# Altium schematic sheet Microcontroller+Memory.SchDoc
size 420 x 297 mm; SheetNumber: 1; SheetTotal: 3
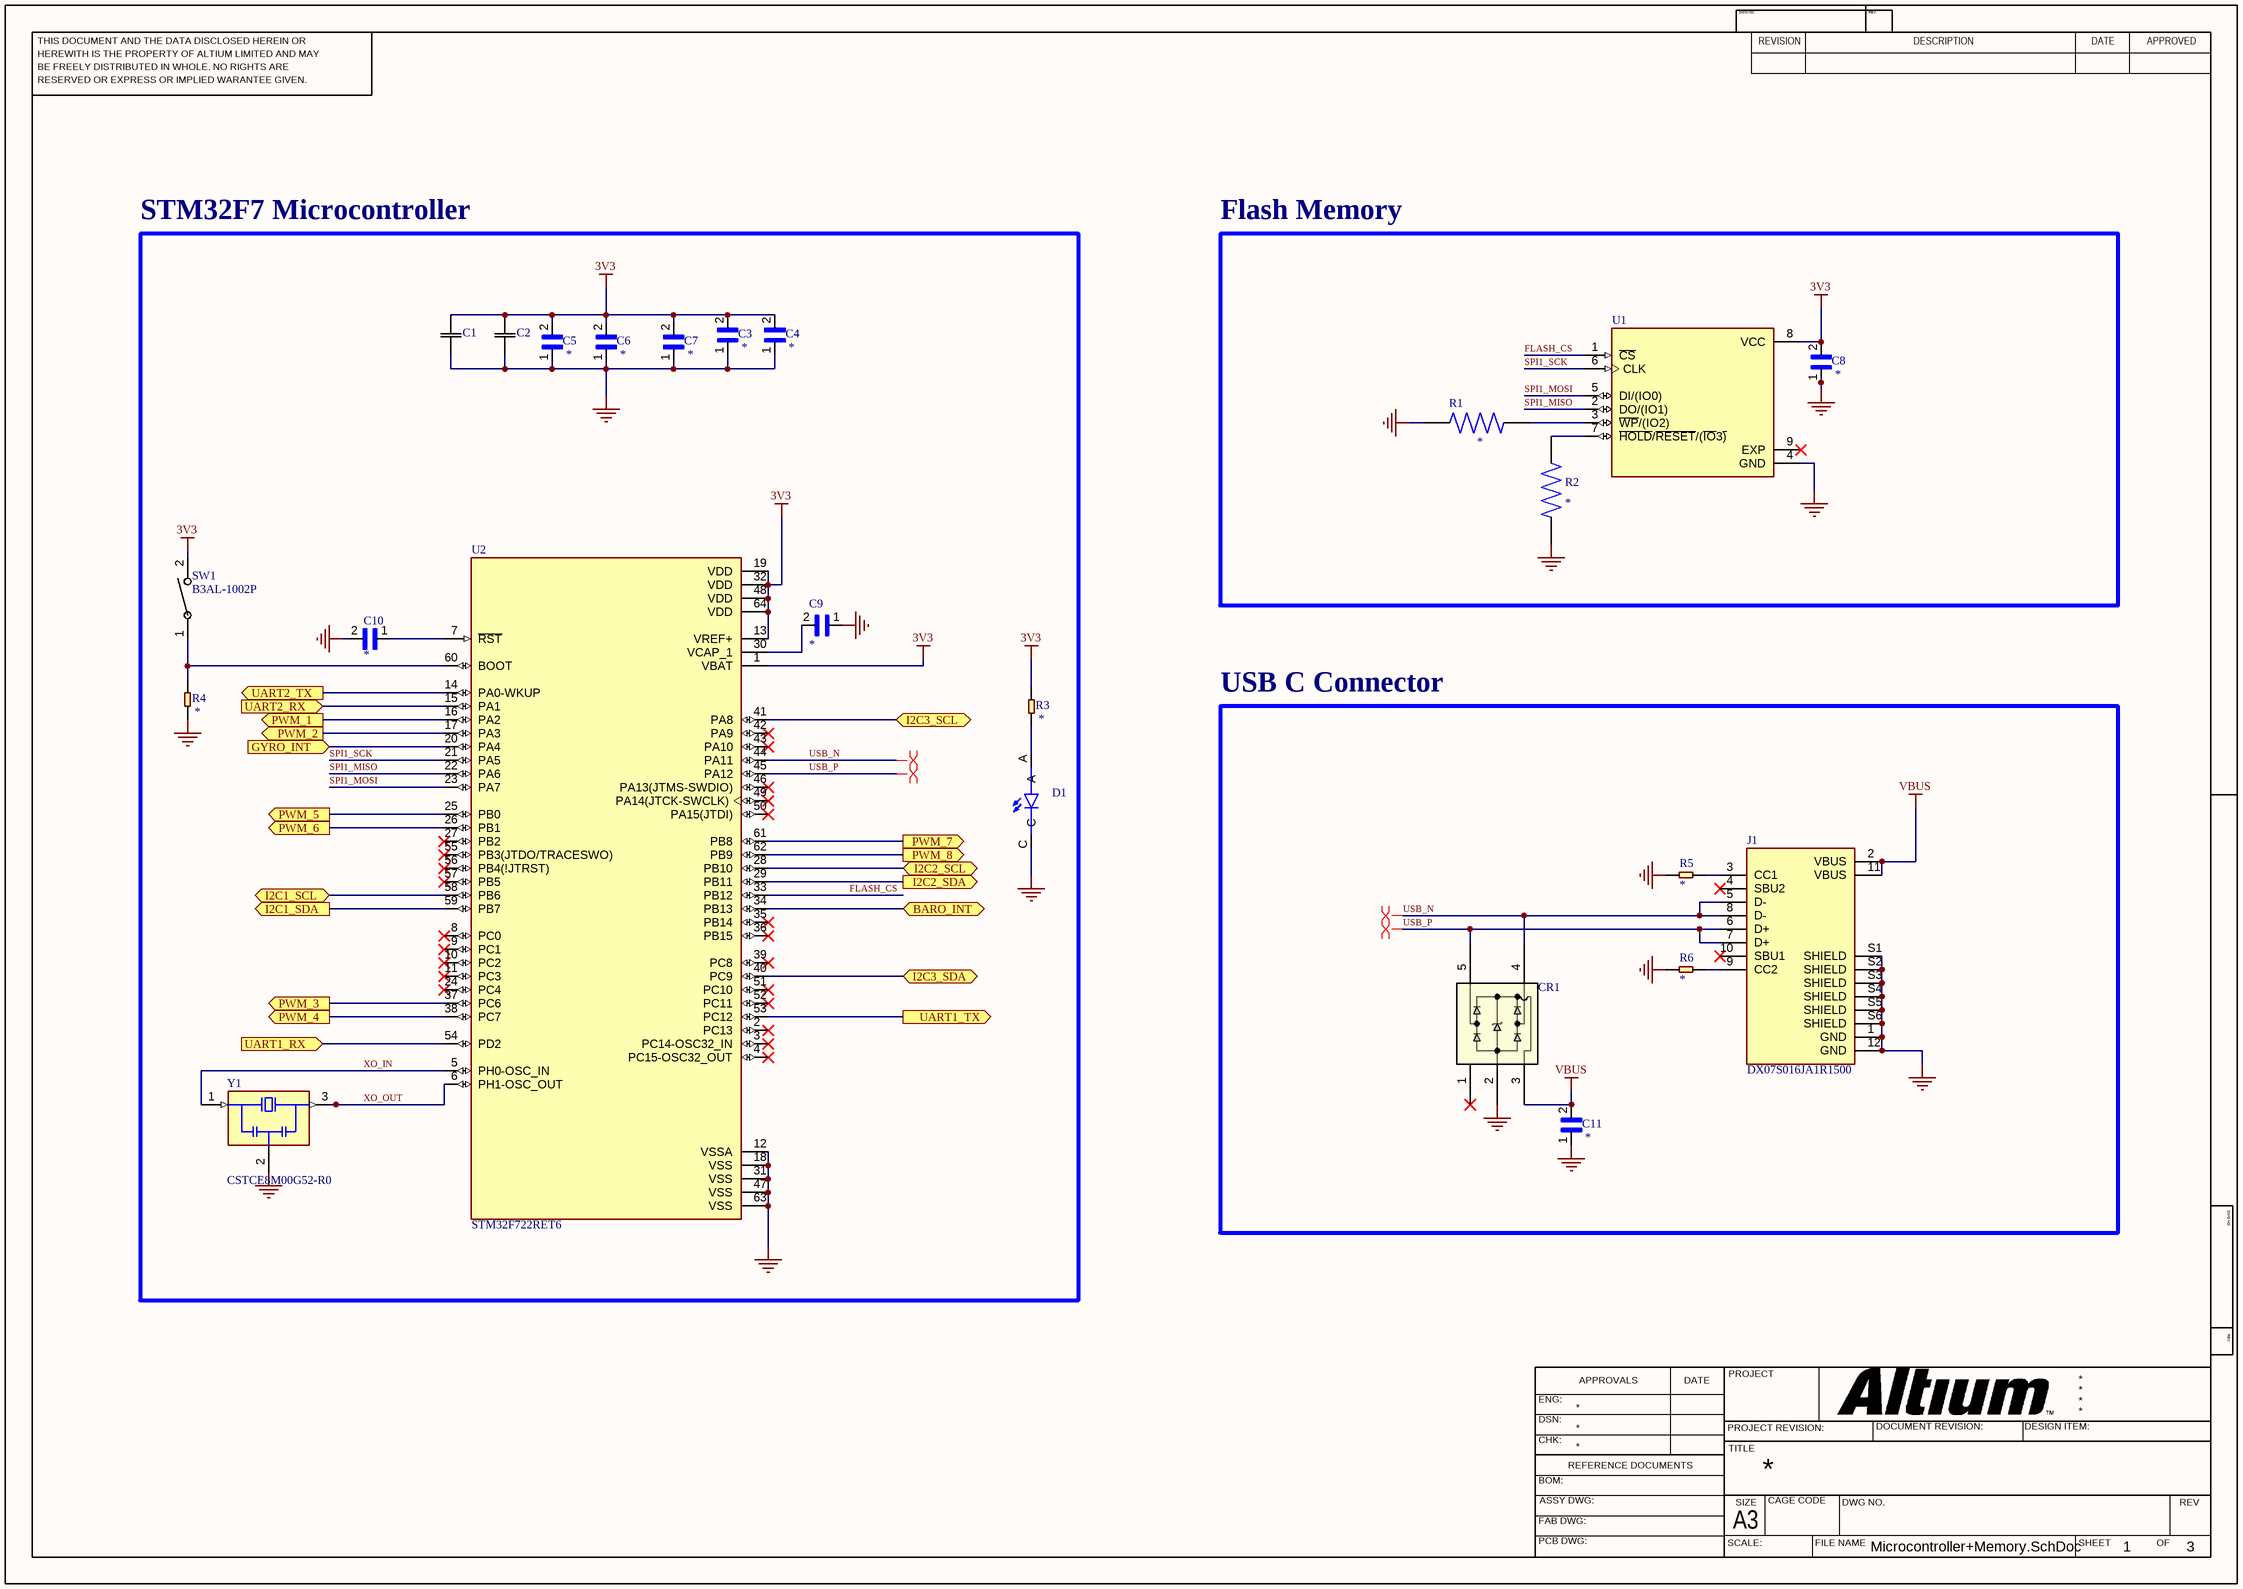
[diagram p0: Microcontroller+Memory.SchDoc]

## Parts
C1  CC0402MRX5R6BB106  [CAP_CC0402_YAG]  (value not drawn)
C2  CC0201MRX5R6BB105  [CAP_CC0201_YAG]  (value not drawn)
C3  GRM033R61A104KE15D  [CAPC0603X33N]  (value not drawn)
C4  GRM033R61A104KE15D  [CAPC0603X33N]  (value not drawn)
C5  GRM033R61A104KE15D  [CAPC0603X33N]  (value not drawn)
C6  GRM033R61A104KE15D  [CAPC0603X33N]  (value not drawn)
C7  GRM033R61A104KE15D  [CAPC0603X33N]  (value not drawn)
C8  GRM033R61A104KE15D  [CAPC0603X33N]  (value not drawn)
C9  CC0402MRX5R6BB475  [CAPC1005X55N]  (value not drawn)
C10  GRM033R61A104KE15D  [CAPC0603X33N]  (value not drawn)
C11  GRM033R61A104KE15D  [CAPC0603X33N]  (value not drawn)
CR1  SP3003-02XTG  [SOT553_LTF]  (value not drawn)
D1  LTST-C190KFKT  [LEDM1608X80]  (value not drawn)
J1  DX07S016JA1R1500  [JAE_DX07S016JA1R1500]
R1  ERA2AEB512X  [RES_ERA2AEB512X]  (value not drawn)
R2  ERA2AEB512X  [RES_ERA2AEB512X]  (value not drawn)
R3  SMD-RES-1K-5%-1/16W(0402)  [R0402]  (value not drawn)
R4  SMD-RES-1K-5%-1/16W(0402)  [R0402]  (value not drawn)
R5  SMD-RES-1K-5%-1/16W(0402)  [R0402]  (value not drawn)
R6  SMD-RES-1K-5%-1/16W(0402)  [R0402]  (value not drawn)
SW1  B3AL-1002P  [SW_3AL-1002P_OMR]
U1  W25Q256JVEIQ_TR  [SON127P600X800X80-9N]  (value not drawn)
U2  STM32F722RET6  [QFP50P1200X1200X160-64N]
Y1  CSTCE8M00G52-R0  [OSC_CSTCE8M00G52-R0]

## Blocks framed on the sheet
STM32F7 Microcontroller: C1-C7 C9 C10 D1 R3 R4 SW1 U2 Y1
Flash Memory: C8 R1 R2 U1
USB C Connector: C11 CR1 J1 R5 R6

## Ports
BARO_INT (bidir), GYRO_INT (in), I2C1_SCL (bidir), I2C1_SDA (out), I2C2_SCL (bidir), I2C2_SDA (out), I2C3_SCL (bidir), I2C3_SDA (bidir), PWM_1 (out), PWM_2 (out), PWM_3 (out), PWM_4 (out), PWM_5 (out), PWM_6 (out), PWM_7 (out), PWM_8 (out), UART1_RX (in), UART1_TX (out), UART2_RX (in), UART2_TX (out)

## Nets
3V3: C1.2 C2.2 C3.2 C4.2 C5.2 C6.2 C7.2 C8.2 R3.2 SW1.2 U1.8(VCC) U2.1(VBAT) U2.13(VREF+) U2.19(VDD) U2.32(VDD) U2.48(VDD) U2.64(VDD)
GND: C1.1 C2.1 C3.1 C4.1 C5.1 C6.1 C7.1 C8.1 C9.1 C10.2 C11.1 CR1.2 D1.C J1.1(GND) J1.12(GND) J1.S1(SHIELD) J1.S2(SHIELD) J1.S3(SHIELD) J1.S4(SHIELD) J1.S5(SHIELD) J1.S6(SHIELD) R1.1 R2.1 R4.1 R5.2 R6.2 U1.4(GND) U2.12(VSSA) U2.18(VSS) U2.31(VSS) U2.47(VSS) U2.63(VSS) Y1.2(GND)
VBUS: C11.2 CR1.3 J1.2(VBUS) J1.11(VBUS)
BARO_INT: U2.34(PB13) ; port BARO_INT
FLASH_CS: U1.1(~{CS}) U2.33(PB12)
GYRO_INT: U2.20(PA4) ; port GYRO_INT
I2C1_SCL: U2.58(PB6) ; port I2C1_SCL
I2C1_SDA: U2.59(PB7) ; port I2C1_SDA
I2C2_SCL: U2.28(PB10) ; port I2C2_SCL
I2C2_SDA: U2.29(PB11) ; port I2C2_SDA
I2C3_SCL: U2.41(PA8) ; port I2C3_SCL
I2C3_SDA: U2.40(PC9) ; port I2C3_SDA
PWM_1: U2.16(PA2) ; port PWM_1
PWM_2: U2.17(PA3) ; port PWM_2
PWM_3: U2.37(PC6) ; port PWM_3
PWM_4: U2.38(PC7) ; port PWM_4
PWM_5: U2.25(PB0) ; port PWM_5
PWM_6: U2.26(PB1) ; port PWM_6
PWM_7: U2.61(PB8) ; port PWM_7
PWM_8: U2.62(PB9) ; port PWM_8
SPI1_MISO: U1.2(DO/(IO1)) U2.22(PA6)
SPI1_MOSI: U1.5(DI/(IO0)) U2.23(PA7)
SPI1_SCK: U1.6(CLK) U2.21(PA5)
UART1_RX: U2.54(PD2) ; port UART1_RX
UART1_TX: U2.53(PC12) ; port UART1_TX
UART2_RX: U2.15(PA1) ; port UART2_RX
UART2_TX: U2.14(PA0-WKUP) ; port UART2_TX
USB_N: CR1.4 J1.5(D-) J1.8(D-) U2.44(PA11)
USB_P: CR1.5 J1.6(D+) J1.7(D+) U2.45(PA12)
XO_IN: U2.5(PH0-OSC_IN) Y1.1(IN)
XO_OUT: U2.6(PH1-OSC_OUT) Y1.3(OUT)
NetC9_2: C9.2 U2.30(VCAP_1)
NetC10_1: C10.1 U2.7(~{RST})
NetD1_A: D1.A R3.1
NetJ1_3: J1.3(CC1) R5.1
NetJ1_9: J1.9(CC2) R6.1
NetR1_2: R1.2 U1.3(~{WP}/(IO2))
NetR2_2: R2.2 U1.7(~{HOLD}/~{RESET}/(~{IO}3~{)})
NetR4_2: R4.2 SW1.1 U2.60(BOOT)

Not connected (* = marked no-connect by the designer): CR1 1*; J1 4(SBU2)* 10(SBU1)*; U1 9(EXP)*; U2 2(PC13)* 3(PC14-OSC32_IN)* 4(PC15-OSC32_OUT)* 8(PC0)* 9(PC1)* 10(PC2)* 11(PC3)* 24(PC4)* 27(PB2)* 35(PB14)* 36(PB15)* 39(PC8)* 42(PA9)* 43(PA10)* 46(PA13(JTMS-SWDIO))* 49(PA14(JTCK-SWCLK))* 50(PA15(JTDI))* 51(PC10)* 52(PC11)* 55(PB3(JTDO/TRACESWO))* 56(PB4(!JTRST))* 57(PB5)*

## Layout directives
differential pair: USB_N, USB_P

## Notes on the sheet
- THIS DOCUMENT AND THE DATA DISCLOSED HEREIN OR
- HEREWITH IS THE PROPERTY OF ALTIUM LIMITED AND MAY
- DWG NO:
- REVISION
- REV:
- DESCRIPTION
- DATE
- APPROVED
- BE FREELY DISTRIBUTED IN WHOLE. NO RIGHTS ARE
- RESERVED OR EXPRESS OR IMPLIED WARANTEE GIVEN.
- ENG:
- APPROVALS
- PROJECT
- DSN:
- CHK:
- REFERENCE DOCUMENTS
- PROJECT REVISION:
- TITLE
- DOCUMENT REVISION:
- DESIGN ITEM:
- BOM:
- FAB DWG:
- PCB DWG:
- ASSY DWG:
- SCALE:
- A3
- SIZE
- CAGE CODE
- FILE NAME
- DWG NO.
- SHEET
- OF
- REV

## Library data of the parts
C1 = CC0402MRX5R6BB106: No Description Available; Mfr_Name: Yageo
C2 = CC0201MRX5R6BB105: No Description Available; Mfr_Name: Yageo
C3-C8 C10 C11 = GRM033R61A104KE15D: SMD capacitor X5R(EIA) with capacitance 0.10uF Tol.10%. Rated voltage 10Vdc 85C; MF: Murata Electronics; Check_prices: https://www.snapeda.com/parts/GRM033R61A104KE15D/Murata%20Electronics%20North%20America/view-part/104758/?ref=eda; Value: *; Availability: Warning; Price: None; Package: 0603 Taiyo Yuden; MP: GRM033R61A104KE15D; Purchase-URL: https://pricing.snapeda.com/search/part/GRM033R61A104KE15D/?ref=eda; SnapEDA_Link: https://www.snapeda.com/parts/GRM033R61A104KE15D/Murata%20Electronics%20North%20America/view-part/104758/?ref=snap
C9 = CC0402MRX5R6BB475: 0402 4700000 pF 10 V Â±20 % Tol. X5R Surface Mount Multilayer Ceramic Capacitor; Package: None; Price: None; Value: *; MP: CC0402MRX5R6BB475; Availability: Unavailable
CR1 = SP3003-02XTG: No Description Available; Mfr_Name: Littelfuse Inc; RefDes: RefDes; Type: Type
D1 = LTST-C190KFKT: LED Uni-Color Orange 611nm 2-Pin Chip LED T/R; MF: Lite-On Electronics; Price: None; MP: LTST-C190KFKT; Purchase-URL: https://pricing.snapeda.com/search/part/LTST-C190KFKT/?ref=eda; Package: 0603 Lite-On; Check_prices: https://www.snapeda.com/parts/LTST-C190KFKT/Applied+Avionics/view-part/?ref=eda; SnapEDA_Link: https://www.snapeda.com/parts/LTST-C190KFKT/Applied+Avionics/view-part/?ref=snap; Value: *; Availability: In Stock
J1 = DX07S016JA1R1500: USB-C (USB TYPE-C) USB 2.0 Receptacle Connector 24 (16+8 Dummy) Position Surface Mount, Right Angle; Through Hole; Package: None; Value: *; Price: None; MP: DX07S016JA1R1500; Availability: Unavailable
R3-R6 = SMD-RES-1K-5%-1/16W(0402): 1 kOhms Â±5% 0.063W, 1/16W Chip Resistor 0402 (1005 Metric) Moisture Resistant Thick Film; MP: RC0402JR-071KL; MF: Yageo; Check_prices: https://www.snapeda.com/parts/RC0402JR-071KL/Yageo/view-part/?ref=eda; Value: *; Purchase-URL: https://pricing.snapeda.com/search/part/RC0402JR-071KL/?ref=eda; SnapEDA_Link: https://www.snapeda.com/parts/RC0402JR-071KL/Yageo/view-part/?ref=snap; Package: 0402 Yageo; Digi-Key_Part_Number: 311-1.0KJRTR-ND
SW1 = B3AL-1002P: No Description Available; Mfr_Name: Omron
U1 = W25Q256JVEIQ_TR: FLASH - NOR Memory IC 256Mb (32M x 8) SPI - Quad I/O 133 MHz 8-WSON (8x6); MP: W25Q256JVEIQ TR; MF: Winbond; Price: None; Purchase-URL: https://pricing.snapeda.com/search/part/W25Q256JVEIQ TR/?ref=eda; Package: WSON-8 Winbond; Check_prices: https://www.snapeda.com/parts/W25Q256JVEIQ%20TR/Winbond+Electronics/view-part/?ref=eda; Value: *; Availability: In Stock; SnapEDA_Link: https://www.snapeda.com/parts/W25Q256JVEIQ%20TR/Winbond+Electronics/view-part/?ref=snap
U2 = STM32F722RET6: ARMÂ® CortexÂ®-M7 STM32F7 Microcontroller IC 32-Bit 216MHz 512KB _512K x 8_ FLASH 64-LQFP _10x10_; MF: STMicroelectronics; SnapEDA_Link: https://www.snapeda.com/parts/STM32F722RET6/STMicroelectronics/view-part/696468/?ref=snap; Availability: Unavailable; Price: None; Package: LQFP-64 STMicroelectronics; MP: STM32F722RET6; Value: *
Y1 = CSTCE8M00G52-R0: 8MHz Ceramic Resonator Built in Capacitor 10pF Â±0.2% -20Â°C ~ 80Â°C Surface Mount; MF: Murata; Price: None; Check_prices: https://www.snapeda.com/parts/CSTCE8M00G52-R0/Murata%20Electronics%20North%20America/view-part/234504/?ref=eda; SnapEDA_Link: https://www.snapeda.com/parts/CSTCE8M00G52-R0/Murata%20Electronics%20North%20America/view-part/234504/?ref=snap; Package: Surface Mount Murata Electronics North America; Availability: Bad; MP: CSTCE8M00G52-R0; Value: *
R1 R2 = ERA2AEB512X: Availability: Unavailable; Package: None; Price: None; Value: *; MP: ERA2AEB512X